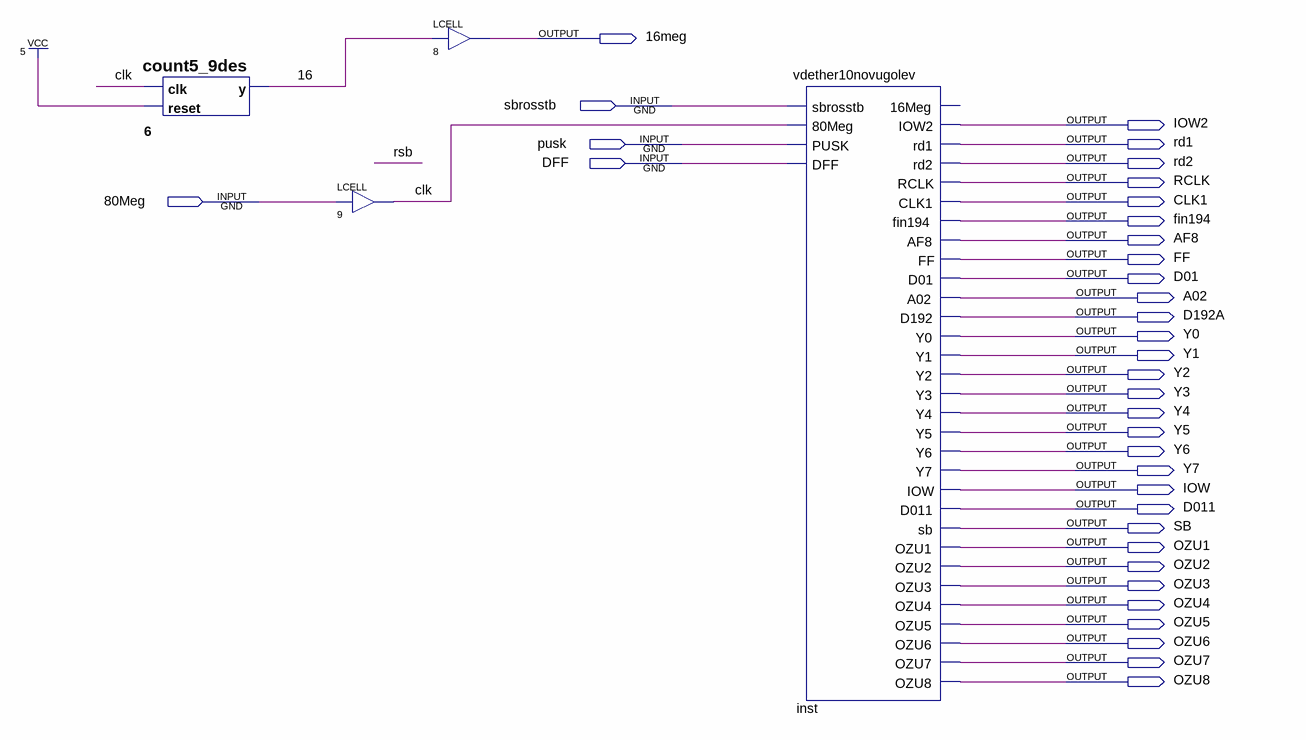
[diagram p0: schematic sheet]
// Quartus schematic proba256_10novugolev.bdf as structural Verilog: 4 symbols, 35 pins
module proba256_10novugolev (
  input  sbrosstb,
  input  pusk,
  input  DFF,
  input  \80Meg ,
  output \16meg ,
  output IOW2,
  output rd1,
  output rd2,
  output RCLK,
  output CLK1,
  output fin194,
  output AF8,
  output FF,
  output D01,
  output A02,
  output D192A,
  output Y0,
  output Y1,
  output Y2,
  output Y3,
  output Y4,
  output Y5,
  output Y6,
  output Y7,
  output IOW,
  output D011,
  output SB,
  output OZU1,
  output OZU2,
  output OZU3,
  output OZU4,
  output OZU5,
  output OZU6,
  output OZU7,
  output OZU8
);

  wire \16 , clk;

  count5_9des u_6 (.clk(clk), .reset(1'b1), .y(\16 ));
  LCELL u_9 (.IN(\80Meg ), .OUT(clk));
  LCELL u_8 (.IN(\16 ), .OUT(\16meg ));
  vdether10novugolev inst (
    .sbrosstb(sbrosstb), .\80Meg (clk), .PUSK(pusk), .DFF(DFF), .IOW2(IOW2), .rd1(rd1), .rd2(rd2),
    .RCLK(RCLK), .CLK1(CLK1), .fin194(fin194), .AF8(AF8), .FF(FF), .D01(D01), .A02(A02), .D192(D192A),
    .Y0(Y0), .Y1(Y1), .Y2(Y2), .Y3(Y3), .Y4(Y4), .Y5(Y5), .Y6(Y6), .Y7(Y7), .IOW(IOW), .D011(D011), .sb(SB),
    .OZU1(OZU1), .OZU2(OZU2), .OZU3(OZU3), .OZU4(OZU4), .OZU5(OZU5), .OZU6(OZU6), .OZU7(OZU7), .OZU8(OZU8));  // open: 16Meg
endmodule
